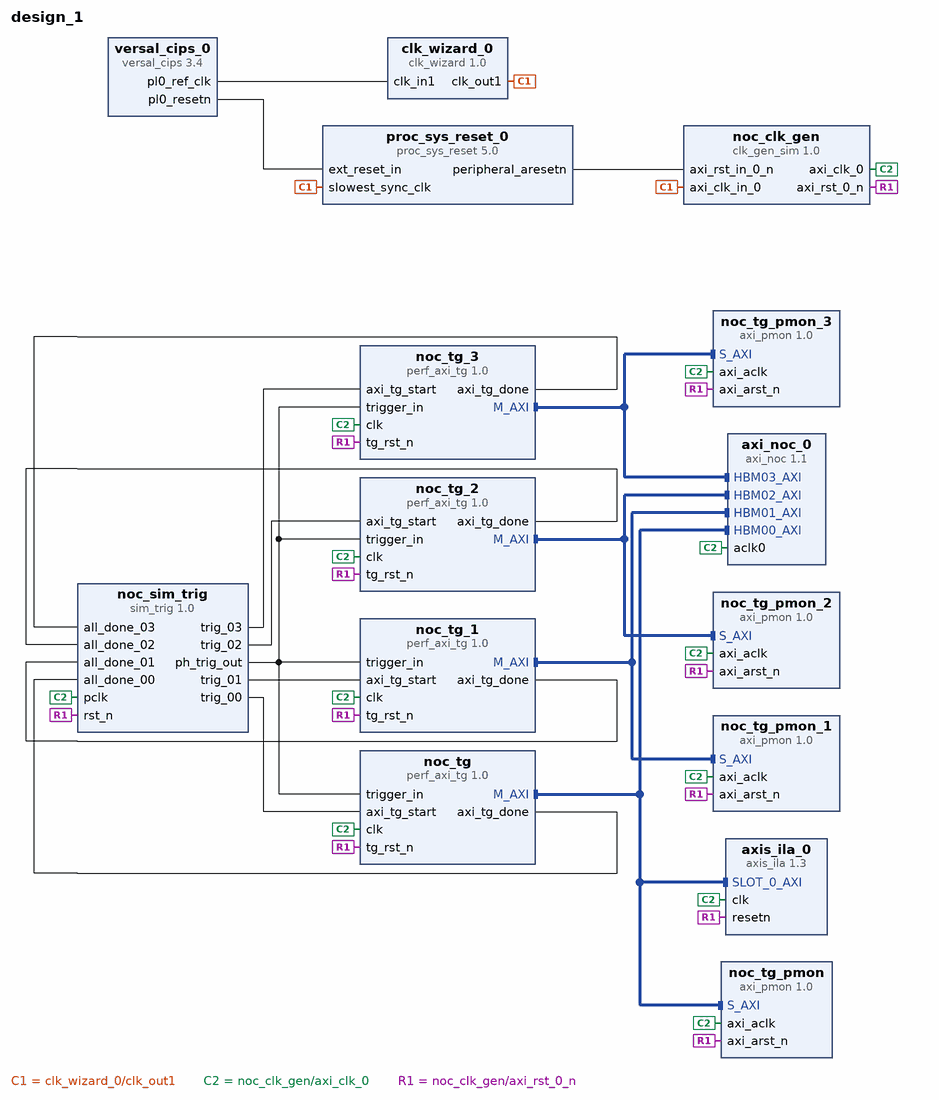
[diagram p0: block diagram of the top level]
# Vivado block design design_1, xcvh1582-vsva3697-2MP-e-S, Vivado 2024.2
create_bd_design design_1

create_bd_cell -type ip -vlnv xilinx.com:ip:axi_noc:1.1 axi_noc_0
set_property -dict [list \
  CONFIG.HBM_NUM_CHNL 1 \
  CONFIG.HBM_REF_CLK_SELECTION Internal \
  CONFIG.NUM_CLKS 1 \
  CONFIG.NUM_HBM_BLI 4 \
  CONFIG.NUM_MI 0 \
  CONFIG.NUM_SI 0 \
] [get_bd_cells axi_noc_0]
create_bd_cell -type ip -vlnv xilinx.com:ip:clk_gen_sim:1.0 noc_clk_gen
set_property -dict {CONFIG.USER_NUM_OF_SYS_CLK 0 CONFIG.USER_SYS_CLK0_FREQ 100.000} [get_bd_cells noc_clk_gen]
create_bd_cell -type ip -vlnv xilinx.com:ip:perf_axi_tg:1.0 noc_tg
set_property -dict [list \
  CONFIG.DG_SCR_SEV true \
  CONFIG.IS_CONN_SLAVE_AXI_NOC true \
  CONFIG.USER_C_AXI_CLK_PERIOD 3333 \
  CONFIG.USER_C_AXI_READ_BASEADDR 0x0000004000000000 \
  CONFIG.USER_C_AXI_READ_HIGHADDR 0x000000403FFFFFFF \
  CONFIG.USER_C_AXI_SLAVE_DATA_WIDTH 128 \
  CONFIG.USER_C_AXI_TEST_SELECT user_defined_pattern \
  CONFIG.USER_C_AXI_WDATA_WIDTH 256 \
  CONFIG.USER_C_AXI_WID_WIDTH 7 \
  CONFIG.USER_C_AXI_WRITE_BASEADDR 0x0000004000000000 \
  CONFIG.USER_C_AXI_WRITE_BASEADDR_SLV 0x0000004000000000 \
  CONFIG.USER_C_AXI_WRITE_HIGHADDR 0x000000403FFFFFFF \
  CONFIG.USER_C_AXI_WRITE_HIGHADDR_SLV 0x000000403FFFFFFF \
  CONFIG.USER_EN_VIO_STATUS_MONITOR FALSE \
  CONFIG.USER_NO_OF_SLAVE_CONNECTED 1 \
  CONFIG.USER_SYNTH_DEFINED_PATTERN_CSV ../../../../../../../tg_synth_wr_followed_by_rd_0.csv \
  CONFIG.USER_USR_DEFINED_PATTERN_CSV ../../../../../../../tg_sim_wr_followed_by_rd_0.csv \
] [get_bd_cells noc_tg]
create_bd_cell -type ip -vlnv xilinx.com:ip:sim_trig:1.0 noc_sim_trig
set_property -dict {CONFIG.USER_NUM_AXI_TG 4} [get_bd_cells noc_sim_trig]
create_bd_cell -type ip -vlnv xilinx.com:ip:axi_pmon:1.0 noc_tg_pmon
set_property -dict {CONFIG.USER_PARAM_AXI_TG_ID 0} [get_bd_cells noc_tg_pmon]
create_bd_cell -type ip -vlnv xilinx.com:ip:perf_axi_tg:1.0 noc_tg_1
set_property -dict [list \
  CONFIG.DG_SCR_SEV true \
  CONFIG.IS_CONN_SLAVE_AXI_NOC true \
  CONFIG.USER_C_AXI_CLK_PERIOD 3333 \
  CONFIG.USER_C_AXI_READ_BASEADDR 0x0000004000000000 \
  CONFIG.USER_C_AXI_READ_HIGHADDR 0x000000403FFFFFFF \
  CONFIG.USER_C_AXI_SLAVE_DATA_WIDTH 128 \
  CONFIG.USER_C_AXI_TEST_SELECT user_defined_pattern \
  CONFIG.USER_C_AXI_WDATA_WIDTH 256 \
  CONFIG.USER_C_AXI_WID_WIDTH 7 \
  CONFIG.USER_C_AXI_WRITE_BASEADDR 0x0000004000000000 \
  CONFIG.USER_C_AXI_WRITE_BASEADDR_SLV 0x0000004000000000 \
  CONFIG.USER_C_AXI_WRITE_HIGHADDR 0x000000403FFFFFFF \
  CONFIG.USER_C_AXI_WRITE_HIGHADDR_SLV 0x000000403FFFFFFF \
  CONFIG.USER_EN_VIO_STATUS_MONITOR FALSE \
  CONFIG.USER_NO_OF_SLAVE_CONNECTED 1 \
  CONFIG.USER_SYNTH_DEFINED_PATTERN_CSV ../../../../../../../tg_synth_wr_followed_by_rd_1.csv \
  CONFIG.USER_USR_DEFINED_PATTERN_CSV ../../../../../../../tg_sim_wr_followed_by_rd_1.csv \
] [get_bd_cells noc_tg_1]
create_bd_cell -type ip -vlnv xilinx.com:ip:axi_pmon:1.0 noc_tg_pmon_1
set_property -dict {CONFIG.USER_PARAM_AXI_TG_ID 1} [get_bd_cells noc_tg_pmon_1]
create_bd_cell -type ip -vlnv xilinx.com:ip:perf_axi_tg:1.0 noc_tg_2
set_property -dict [list \
  CONFIG.DG_SCR_SEV true \
  CONFIG.IS_CONN_SLAVE_AXI_NOC true \
  CONFIG.USER_C_AXI_CLK_PERIOD 3333 \
  CONFIG.USER_C_AXI_READ_BASEADDR 0x0000004040000000 \
  CONFIG.USER_C_AXI_READ_HIGHADDR 0x000000407FFFFFFF \
  CONFIG.USER_C_AXI_SLAVE_DATA_WIDTH 128 \
  CONFIG.USER_C_AXI_TEST_SELECT user_defined_pattern \
  CONFIG.USER_C_AXI_WDATA_WIDTH 256 \
  CONFIG.USER_C_AXI_WID_WIDTH 7 \
  CONFIG.USER_C_AXI_WRITE_BASEADDR 0x0000004040000000 \
  CONFIG.USER_C_AXI_WRITE_BASEADDR_SLV 0x0000004040000000 \
  CONFIG.USER_C_AXI_WRITE_HIGHADDR 0x000000407FFFFFFF \
  CONFIG.USER_C_AXI_WRITE_HIGHADDR_SLV 0x000000407FFFFFFF \
  CONFIG.USER_EN_VIO_STATUS_MONITOR FALSE \
  CONFIG.USER_NO_OF_SLAVE_CONNECTED 1 \
  CONFIG.USER_SYNTH_DEFINED_PATTERN_CSV ../../../../../../../tg_synth_wr_followed_by_rd_2.csv \
  CONFIG.USER_USR_DEFINED_PATTERN_CSV ../../../../../../../tg_sim_wr_followed_by_rd_2.csv \
] [get_bd_cells noc_tg_2]
create_bd_cell -type ip -vlnv xilinx.com:ip:axi_pmon:1.0 noc_tg_pmon_2
set_property -dict {CONFIG.USER_PARAM_AXI_TG_ID 2} [get_bd_cells noc_tg_pmon_2]
create_bd_cell -type ip -vlnv xilinx.com:ip:perf_axi_tg:1.0 noc_tg_3
set_property -dict [list \
  CONFIG.DG_SCR_SEV true \
  CONFIG.IS_CONN_SLAVE_AXI_NOC true \
  CONFIG.USER_C_AXI_CLK_PERIOD 3333 \
  CONFIG.USER_C_AXI_READ_BASEADDR 0x0000004040000000 \
  CONFIG.USER_C_AXI_READ_HIGHADDR 0x000000407FFFFFFF \
  CONFIG.USER_C_AXI_SLAVE_DATA_WIDTH 128 \
  CONFIG.USER_C_AXI_TEST_SELECT user_defined_pattern \
  CONFIG.USER_C_AXI_WDATA_WIDTH 256 \
  CONFIG.USER_C_AXI_WID_WIDTH 7 \
  CONFIG.USER_C_AXI_WRITE_BASEADDR 0x0000004040000000 \
  CONFIG.USER_C_AXI_WRITE_BASEADDR_SLV 0x0000004040000000 \
  CONFIG.USER_C_AXI_WRITE_HIGHADDR 0x000000407FFFFFFF \
  CONFIG.USER_C_AXI_WRITE_HIGHADDR_SLV 0x000000407FFFFFFF \
  CONFIG.USER_NO_OF_SLAVE_CONNECTED 1 \
  CONFIG.USER_SYNTH_DEFINED_PATTERN_CSV ../../../../../../../tg_synth_wr_followed_by_rd_3.csv \
  CONFIG.USER_USR_DEFINED_PATTERN_CSV ../../../../../../../tg_sim_wr_followed_by_rd_3.csv \
] [get_bd_cells noc_tg_3]
create_bd_cell -type ip -vlnv xilinx.com:ip:axi_pmon:1.0 noc_tg_pmon_3
set_property -dict {CONFIG.USER_PARAM_AXI_TG_ID 3} [get_bd_cells noc_tg_pmon_3]
create_bd_cell -type ip -vlnv xilinx.com:ip:versal_cips:3.4 versal_cips_0
set_property -dict [list \
  CONFIG.CLOCK_MODE Custom \
  CONFIG.PS_PMC_CONFIG {CLOCK_MODE Custom PMC_CRP_PL0_REF_CTRL_FREQMHZ 100 PS_NUM_FABRIC_RESETS 1 PS_USE_PMCPL_CLK0 1 SMON_ALARMS Set_Alarms_On SMON_ENABLE_TEMP_AVERAGING 0 SMON_TEMP_AVERAGING_SAMPLES 0} \
] [get_bd_cells versal_cips_0]
create_bd_cell -type ip -vlnv xilinx.com:ip:proc_sys_reset:5.0 proc_sys_reset_0
create_bd_cell -type ip -vlnv xilinx.com:ip:clk_wizard:1.0 clk_wizard_0
set_property -dict [list \
  CONFIG.CLKOUT_DRIVES BUFG,BUFG,BUFG,BUFG,BUFG,BUFG,BUFG \
  CONFIG.CLKOUT_DYN_PS None,None,None,None,None,None,None \
  CONFIG.CLKOUT_GROUPING Auto,Auto,Auto,Auto,Auto,Auto,Auto \
  CONFIG.CLKOUT_MATCHED_ROUTING false,false,false,false,false,false,false \
  CONFIG.CLKOUT_PORT clk_out1,clk_out2,clk_out3,clk_out4,clk_out5,clk_out6,clk_out7 \
  CONFIG.CLKOUT_REQUESTED_DUTY_CYCLE 50.000,50.000,50.000,50.000,50.000,50.000,50.000 \
  CONFIG.CLKOUT_REQUESTED_OUT_FREQUENCY 300,100.000,100.000,100.000,100.000,100.000,100.000 \
  CONFIG.CLKOUT_REQUESTED_PHASE 0.000,0.000,0.000,0.000,0.000,0.000,0.000 \
  CONFIG.CLKOUT_USED true,false,false,false,false,false,false \
] [get_bd_cells clk_wizard_0]
create_bd_cell -type ip -vlnv xilinx.com:ip:axis_ila:1.3 axis_ila_0
set_property -dict {CONFIG.C_MON_TYPE Interface_Monitor} [get_bd_cells axis_ila_0]

# ---- connections ----

connect_bd_intf_net [get_bd_intf_pins noc_tg_1/M_AXI] [get_bd_intf_pins axi_noc_0/HBM01_AXI]
connect_bd_intf_net [get_bd_intf_pins noc_tg_1/M_AXI] [get_bd_intf_pins noc_tg_pmon_1/S_AXI]
connect_bd_intf_net [get_bd_intf_pins noc_tg_2/M_AXI] [get_bd_intf_pins axi_noc_0/HBM02_AXI]
connect_bd_intf_net [get_bd_intf_pins noc_tg_2/M_AXI] [get_bd_intf_pins noc_tg_pmon_2/S_AXI]
connect_bd_intf_net [get_bd_intf_pins noc_tg_3/M_AXI] [get_bd_intf_pins axi_noc_0/HBM03_AXI]
connect_bd_intf_net [get_bd_intf_pins noc_tg_3/M_AXI] [get_bd_intf_pins noc_tg_pmon_3/S_AXI]
connect_bd_intf_net [get_bd_intf_pins noc_tg/M_AXI] [get_bd_intf_pins axi_noc_0/HBM00_AXI]
connect_bd_intf_net [get_bd_intf_pins noc_tg/M_AXI] [get_bd_intf_pins noc_tg_pmon/S_AXI]
connect_bd_intf_net [get_bd_intf_pins noc_tg/M_AXI] [get_bd_intf_pins axis_ila_0/SLOT_0_AXI]
connect_bd_net [get_bd_pins clk_wizard_0/clk_out1] [get_bd_pins proc_sys_reset_0/slowest_sync_clk] [get_bd_pins noc_clk_gen/axi_clk_in_0]
connect_bd_net [get_bd_pins noc_clk_gen/axi_clk_0] \
  [get_bd_pins noc_sim_trig/pclk] [get_bd_pins noc_tg/clk] [get_bd_pins noc_tg_1/clk] [get_bd_pins noc_tg_2/clk] \
  [get_bd_pins noc_tg_3/clk] [get_bd_pins noc_tg_pmon/axi_aclk] [get_bd_pins noc_tg_pmon_1/axi_aclk] \
  [get_bd_pins noc_tg_pmon_2/axi_aclk] [get_bd_pins noc_tg_pmon_3/axi_aclk] [get_bd_pins axi_noc_0/aclk0] \
  [get_bd_pins axis_ila_0/clk]
connect_bd_net [get_bd_pins noc_clk_gen/axi_rst_0_n] \
  [get_bd_pins noc_sim_trig/rst_n] [get_bd_pins noc_tg/tg_rst_n] [get_bd_pins noc_tg_1/tg_rst_n] \
  [get_bd_pins noc_tg_2/tg_rst_n] [get_bd_pins noc_tg_3/tg_rst_n] [get_bd_pins noc_tg_pmon/axi_arst_n] \
  [get_bd_pins noc_tg_pmon_1/axi_arst_n] [get_bd_pins noc_tg_pmon_2/axi_arst_n] [get_bd_pins noc_tg_pmon_3/axi_arst_n] \
  [get_bd_pins axis_ila_0/resetn]
connect_bd_net [get_bd_pins noc_sim_trig/ph_trig_out] \
  [get_bd_pins noc_tg/trigger_in] [get_bd_pins noc_tg_1/trigger_in] [get_bd_pins noc_tg_2/trigger_in] \
  [get_bd_pins noc_tg_3/trigger_in]
connect_bd_net [get_bd_pins noc_sim_trig/trig_00] [get_bd_pins noc_tg/axi_tg_start]
connect_bd_net [get_bd_pins noc_sim_trig/trig_01] [get_bd_pins noc_tg_1/axi_tg_start]
connect_bd_net [get_bd_pins noc_sim_trig/trig_02] [get_bd_pins noc_tg_2/axi_tg_start]
connect_bd_net [get_bd_pins noc_sim_trig/trig_03] [get_bd_pins noc_tg_3/axi_tg_start]
connect_bd_net [get_bd_pins noc_tg_1/axi_tg_done] [get_bd_pins noc_sim_trig/all_done_01]
connect_bd_net [get_bd_pins noc_tg_2/axi_tg_done] [get_bd_pins noc_sim_trig/all_done_02]
connect_bd_net [get_bd_pins noc_tg_3/axi_tg_done] [get_bd_pins noc_sim_trig/all_done_03]
connect_bd_net [get_bd_pins noc_tg/axi_tg_done] [get_bd_pins noc_sim_trig/all_done_00]
connect_bd_net [get_bd_pins proc_sys_reset_0/peripheral_aresetn] [get_bd_pins noc_clk_gen/axi_rst_in_0_n]
connect_bd_net [get_bd_pins versal_cips_0/pl0_ref_clk] [get_bd_pins clk_wizard_0/clk_in1]
connect_bd_net [get_bd_pins versal_cips_0/pl0_resetn] [get_bd_pins proc_sys_reset_0/ext_reset_in]

# ---- address map ----
assign_bd_address -offset 0x0000004000000000 -range 1G -target_address_space [get_bd_addr_spaces noc_tg/Data] [get_bd_addr_segs axi_noc_0/HBM00_AXI/HBM0_PC0]
assign_bd_address -offset 0x0000004000000000 -range 1G -target_address_space [get_bd_addr_spaces noc_tg_1/Data] [get_bd_addr_segs axi_noc_0/HBM01_AXI/HBM0_PC0]
assign_bd_address -offset 0x0000004040000000 -range 1G -target_address_space [get_bd_addr_spaces noc_tg_2/Data] [get_bd_addr_segs axi_noc_0/HBM02_AXI/HBM0_PC1]
assign_bd_address -offset 0x0000004040000000 -range 1G -target_address_space [get_bd_addr_spaces noc_tg_3/Data] [get_bd_addr_segs axi_noc_0/HBM03_AXI/HBM0_PC1]

validate_bd_design
save_bd_design
